# Altium schematic sheet schematic_drive_2024-08-23.schdoc
size 566 x 556 mm
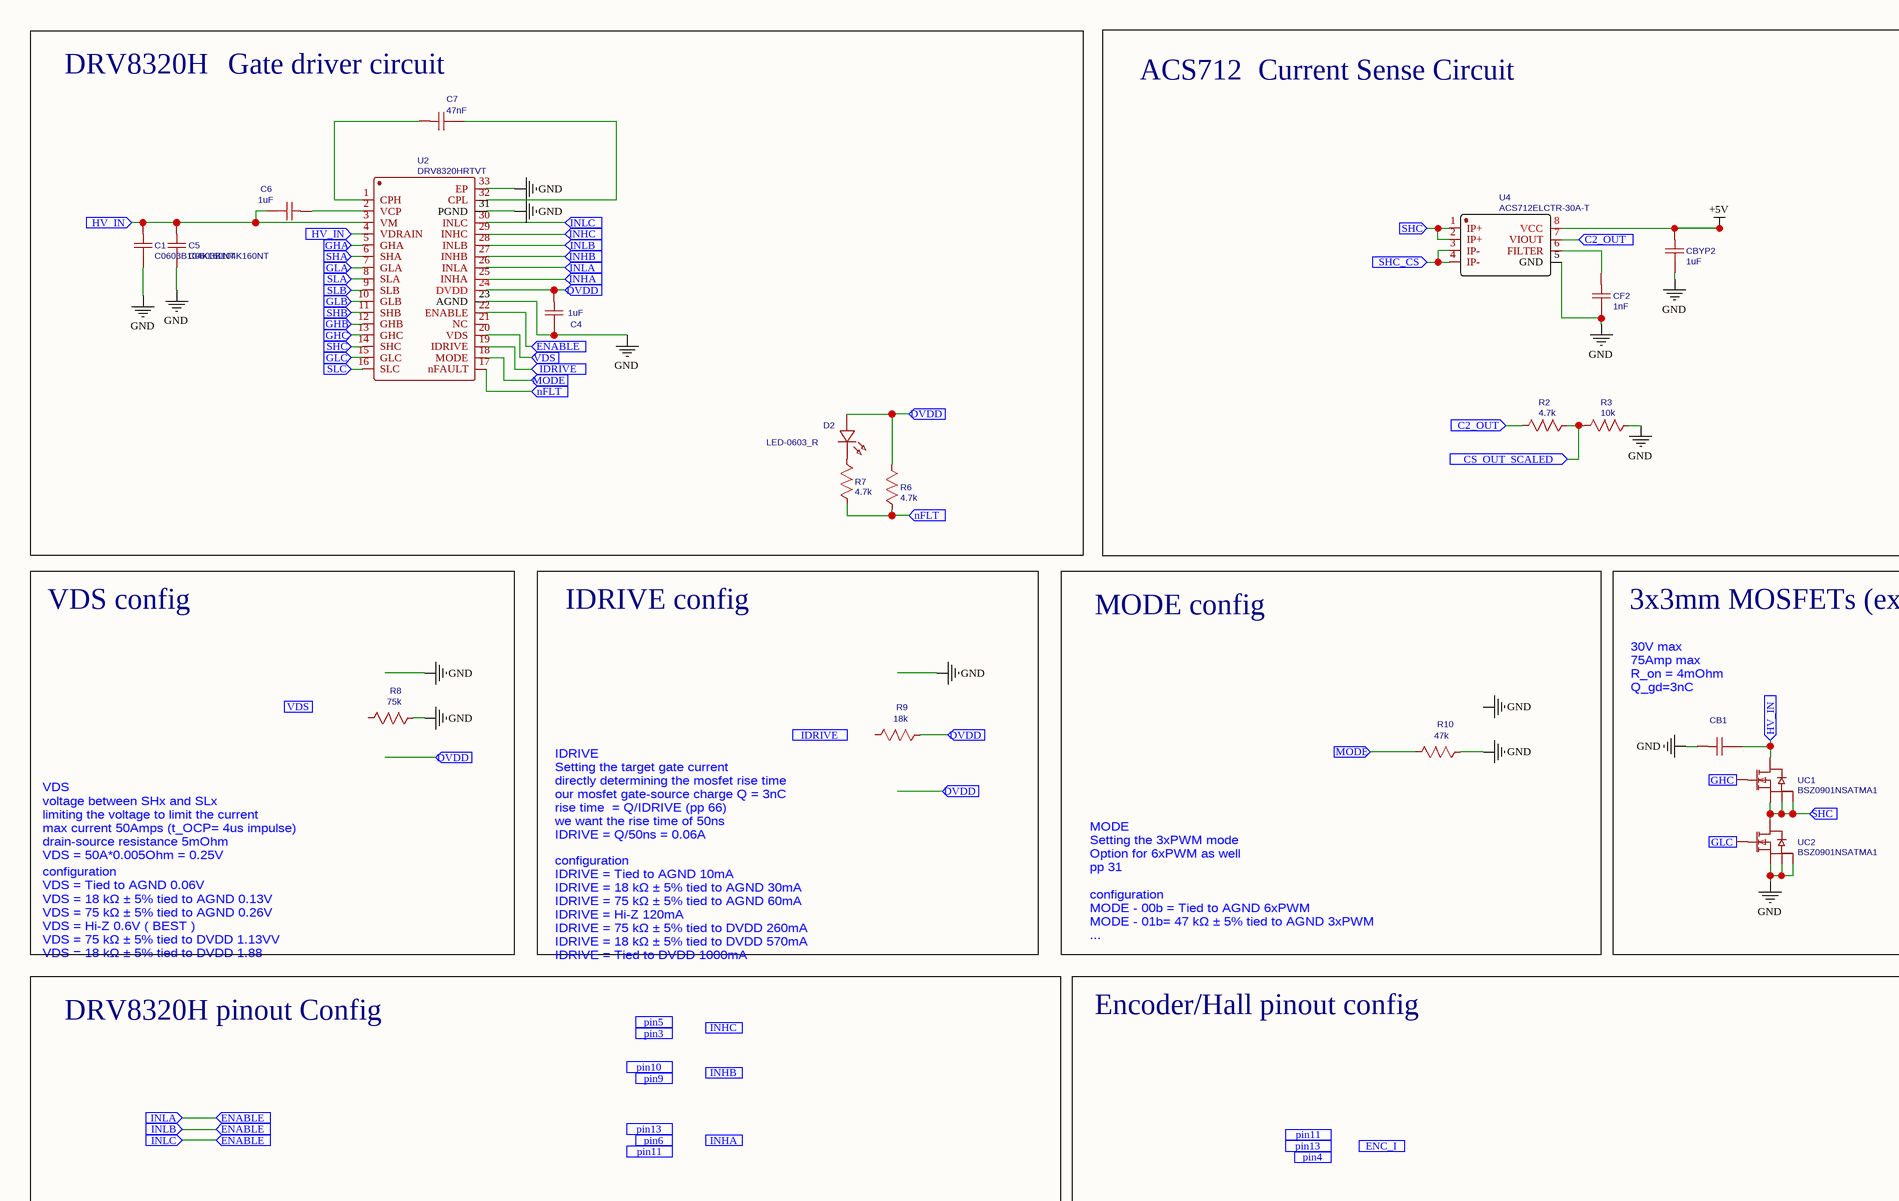
[diagram p0: schematic_drive_2024-08-23.schdoc, top left]
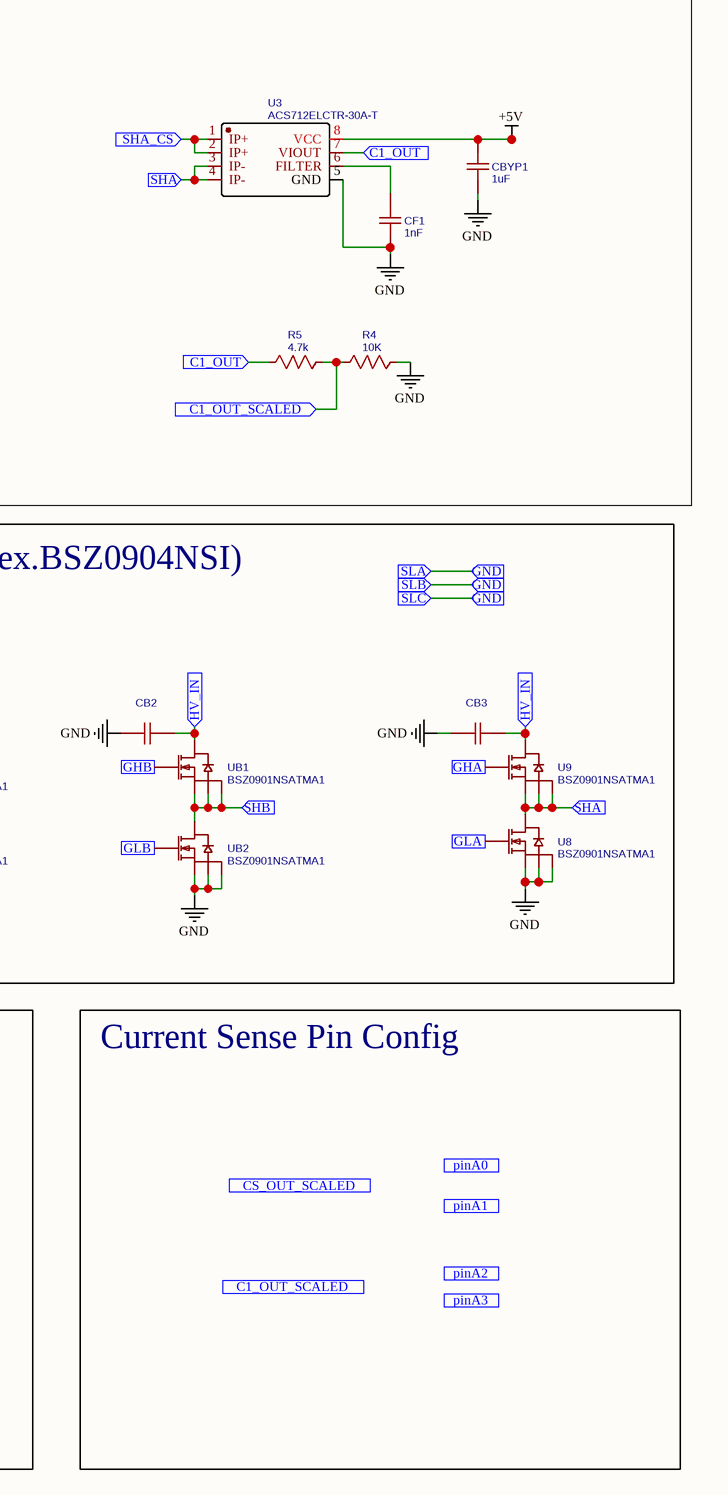
[diagram p1: schematic_drive_2024-08-23.schdoc, top right]
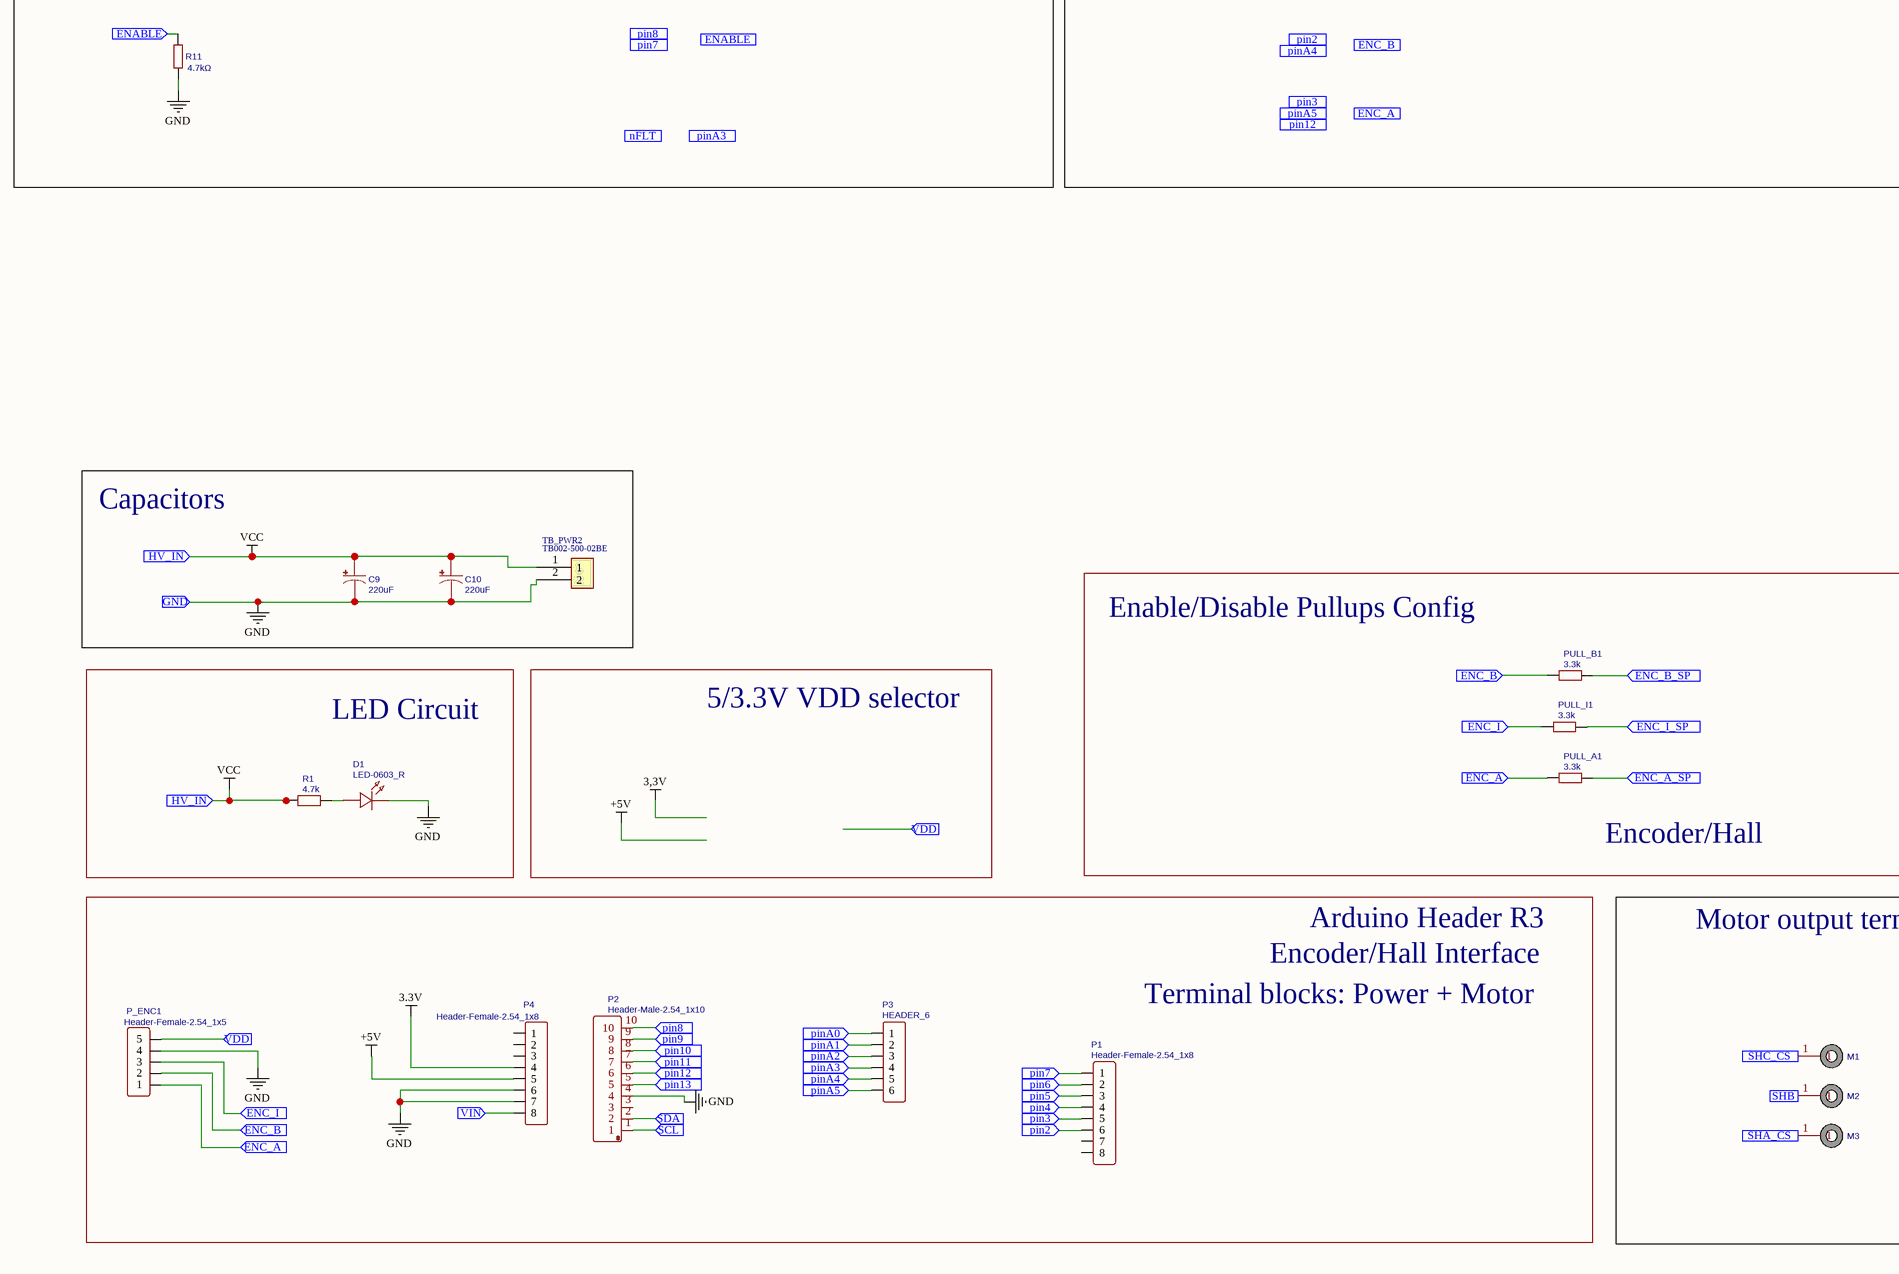
[diagram p2: schematic_drive_2024-08-23.schdoc, bottom left]
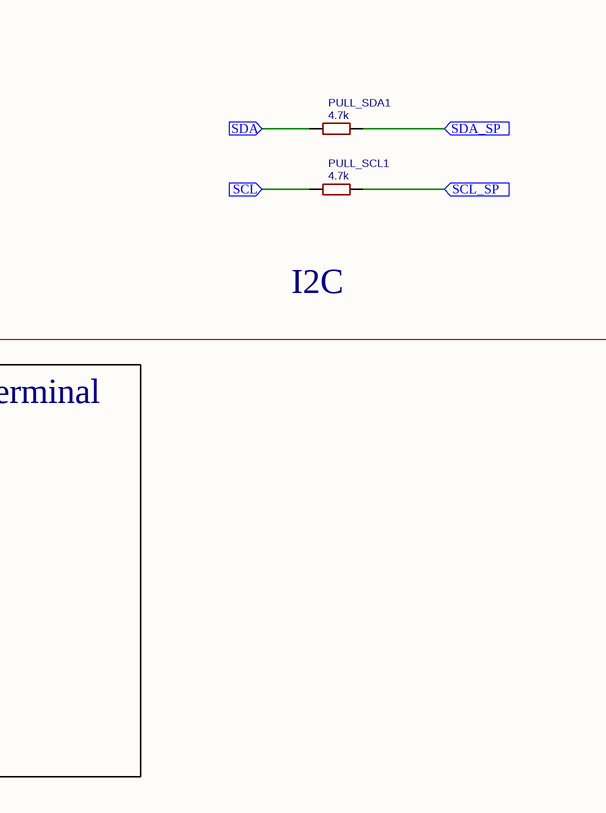
[diagram p3: schematic_drive_2024-08-23.schdoc, bottom right]

## Parts
C1  C0603B104K160NT  [C0603]
C4  1uF  [C0603]
C5  C0603B104K160NT  [C0603]
C6  1uF  [C0603]
C7  47nF  [C0603]
C9  220uF  [CAP-SMD_BD8.0-L8.3-W8.3-LS9.5-FD]
C10  220uF  [CAP-SMD_BD8.0-L8.3-W8.3-LS9.5-FD]
CB1  C0603B104K160NT  [C0603]  (value not drawn)
CB2  C0603B104K160NT  [C0603]  (value not drawn)
CB3  C0603B104K160NT  [C0603]  (value not drawn)
CBYP1  1uF  [C0603]
CBYP2  1uF  [C0603]
CF1  1nF  [C0603]
CF2  1nF  [C0603]
D1  LED-0603_R  [LED0603_RED]
D2  LED-0603_R  [LED0603_RED]
M1  M2 PLATED HOLE WITH MINI HOLES  [M2 PLATED HOLE WITH MINI HOLES]  (value not drawn)
M2  M2 PLATED HOLE WITH MINI HOLES  [M2 PLATED HOLE WITH MINI HOLES]  (value not drawn)
M3  M2 PLATED HOLE WITH MINI HOLES  [M2 PLATED HOLE WITH MINI HOLES]  (value not drawn)
P1  Header-Female-2.54_1x8  [HDR-TH_8P-P2.54-V-F-1]
P2  Header-Male-2.54_1x10  [HDR-TH_10P-P2.54-V-M-1]
P3  HEADER_6  [HDR-M-2.54_1X6]
P4  Header-Female-2.54_1x8  [HDR-TH_8P-P2.54-V-F-1]
P_ENC1  Header-Female-2.54_1x5  [HDR-TH_5P-P2.54-V-F]
PULL_A1  3.3k  [R0603]
PULL_B1  3.3k  [R0603]
PULL_I1  3.3k  [R0603]
PULL_SCL1  4.7k  [R0603]
PULL_SDA1  4.7k  [R0603]
R1  4.7k  [R0603]
R2  4.7k  [R0603]
R3  10k  [R0603]
R4  10K  [R0603]
R5  4.7k  [R0603]
R6  4.7k  [R0603]
R7  4.7k  [R0603]
R8  75k  [R0603]
R9  18k  [R0603]
R10  47k  [R0603]
R11  4.7kΩ  [R0603]
TB_PWR2  TB002-500-02BE  [TB002-500-02BE]
U2  DRV8320HRTVT  [WQFN-32_L5.0-W5.0-P0.50-TL-EP]
U3  ACS712ELCTR-30A-T  [SOIC-8_L5.0-W4.0-P1.27-LS6.0-BL]
U4  ACS712ELCTR-30A-T  [SOIC-8_L5.0-W4.0-P1.27-LS6.0-BL]
U8  BSZ0901NSATMA1  [DFN-8_L3.3-W3.3-P0.65-BL-2]
U9  BSZ0901NSATMA1  [DFN-8_L3.3-W3.3-P0.65-BL-2]
UB1  BSZ0901NSATMA1  [DFN-8_L3.3-W3.3-P0.65-BL-2]
UB2  BSZ0901NSATMA1  [DFN-8_L3.3-W3.3-P0.65-BL-2]
UC1  BSZ0901NSATMA1  [DFN-8_L3.3-W3.3-P0.65-BL-2]
UC2  BSZ0901NSATMA1  [DFN-8_L3.3-W3.3-P0.65-BL-2]

## Blocks framed on the sheet
VDS config: R8
IDRIVE config: R9
MODE config: R10
3x3mm MOSFETs (ex.BSZ0904NSI): CB1-CB3 U8 U9 UB1 UB2 UC1 UC2
DRV8320H pinout Config: R11
Capacitors: C9 C10 TB_PWR2
LED Circuit: D1 R1
Motor output terminal: M1-M3

## Ports
C1_OUT (in), C1_OUT_SCALED (in), C2_OUT (in), CS_OUT_SCALED (in), DVDD (in), ENABLE (in), ENC_A (in), ENC_A_SP (in), ENC_B (in), ENC_B_SP (in), ENC_I (in), ENC_I_SP (in), GHA (in), GHB (in), GHC (in), GLA (in), GLB (in), GLC (in), GND (in), HV_IN (in), IDRIVE (in), INHA (in), INHB (in), INHC (in), INLA (in), INLB (in), INLC (in), MODE (in), nFLT (in), pin2 (in), pin3 (in), pin4 (in), pin5 (in), pin6 (in), pin7 (in), pin8 (in), pin9 (in), pin10 (in), pin11 (in), pin12 (in), pin13 (in), pinA0 (in), pinA1 (in), pinA2 (in), pinA3 (in), pinA4 (in), pinA5 (in), SCL (in), SCL_SP (in), SDA (in), SDA_SP (in), SHA (in), SHA_CS (in), SHB (in), SHC (in), SHC_CS (in), SLA (in), SLB (in), SLC (in), VDD (in), VDS (in), VIN (in)

## Nets
3.3V: P4.4
+5V: CBYP1.2 CBYP2.2 P4.5 U3.8(VCC) U4.8(VCC)
GND: C1.1 C4.1 C5.1 C9.2 C10.2 CB1.2 CB2.1 CB3.2 CBYP1.1 CBYP2.1 CF1.1 CF2.1 D1.2 P2.4 P4.6 P4.7 P_ENC1.4 R3.2 R4.2 R8.2 R10.2 R11.1 TB_PWR2.2 U2.8(SLA) U2.9(SLB) U2.16(SLC) U2.23(AGND) U2.31(PGND) U2.33(EP) U3.5(GND) U4.5(GND) U8.1(S) U8.2(S) U8.3(S) UB2.1(S) UB2.2(S) UB2.3(S) UC2.1(S) UC2.2(S) UC2.3(S) ; port SLC, port SLB, port SLA, port GND
VCC: C1.2 C5.2 C6.1 C9.1 C10.1 CB1.1 CB2.2 CB3.1 R1.2 TB_PWR2.1 U2.3(VM) U2.4(VDRAIN) U9.5(D) UB1.5(D) UC1.5(D) ; port HV_IN
C1_OUT: R5.1 U3.7(VIOUT) ; port C1_OUT
C1_OUT_SCALED: R4.1 R5.2 ; port C1_OUT_SCALED
C2_OUT: R2.1 U4.7(VIOUT) ; port C2_OUT
CS_OUT_SCALED: R2.2 R3.1 ; port CS_OUT_SCALED
DVDD: C4.2 D2.1 R6.2 R9.2 U2.24(DVDD) ; port DVDD
ENABLE: R11.2 U2.22(ENABLE) U2.26(INLA) U2.28(INLB) U2.30(INLC) ; port ENABLE, port INLA, port INLB, port INLC
ENC_A: P_ENC1.1 PULL_A1.2 ; port ENC_A
ENC_A_SP: PULL_A1.1 ; port ENC_A_SP
ENC_B: P_ENC1.2 PULL_B1.2 ; port ENC_B
ENC_B_SP: PULL_B1.1 ; port ENC_B_SP
ENC_I: P_ENC1.3 PULL_I1.2 ; port ENC_I
ENC_I_SP: PULL_I1.1 ; port ENC_I_SP
GHA: U2.5(GHA) U9.4(G) ; port GHA
GHB: U2.12(GHB) UB1.4(G) ; port GHB
GHC: U2.13(GHC) UC1.4(G) ; port GHC
GLA: U2.7(GLA) U8.4(G) ; port GLA
GLB: U2.10(GLB) UB2.4(G) ; port GLB
GLC: U2.15(GLC) UC2.4(G) ; port GLC
IDRIVE: U2.19(IDRIVE) ; port IDRIVE
INHA: U2.25(INHA) ; port INHA
INHB: U2.27(INHB) ; port INHB
INHC: U2.29(INHC) ; port INHC
MODE: R10.1 U2.18(MODE) ; port MODE
nFLT: R6.1 R7.1 U2.17(nFAULT) ; port nFLT
pin2: P1.6 ; port pin2
pin3: P1.5 ; port pin3
pin4: P1.4 ; port pin4
pin5: P1.3 ; port pin5
pin6: P1.2 ; port pin6
pin7: P1.1 ; port pin7
pin8: P2.10 ; port pin8
pin9: P2.9 ; port pin9
pin10: P2.8 ; port pin10
pin11: P2.7 ; port pin11
pin12: P2.6 ; port pin12
pin13: P2.5 ; port pin13
pinA0: P3.1 ; port pinA0
pinA1: P3.2 ; port pinA1
pinA2: P3.3 ; port pinA2
pinA3: P3.4 ; port pinA3
pinA4: P3.5 ; port pinA4
pinA5: P3.6 ; port pinA5
SCL: P2.1 PULL_SCL1.2 ; port SCL
SCL_SP: PULL_SCL1.1 ; port SCL_SP
SDA: P2.2 PULL_SDA1.2 ; port SDA
SDA_SP: PULL_SDA1.1 ; port SDA_SP
SHA: U2.6(SHA) U3.3(IP-) U3.4(IP-) U8.5(D) U9.1(S) U9.2(S) U9.3(S) ; port SHA
SHA_CS: M3.1 U3.1(IP+) U3.2(IP+) ; port SHA_CS
SHB: M2.1 U2.11(SHB) UB1.1(S) UB1.2(S) UB1.3(S) UB2.5(D) ; port SHB
SHC: U2.14(SHC) U4.1(IP+) U4.2(IP+) UC1.1(S) UC1.2(S) UC1.3(S) UC2.5(D) ; port SHC
SHC_CS: M1.1 U4.3(IP-) U4.4(IP-) ; port SHC_CS
VDD: P_ENC1.5 ; port VDD
VDS: U2.20(VDS) ; port VDS
VIN: P4.8 ; port VIN
NetC6_2: C6.2 U2.2(VCP)
NetC7_1: C7.1 U2.32(CPL)
NetC7_2: C7.2 U2.1(CPH)
NetCF1_2: CF1.2 U3.6(FILTER)
NetCF2_2: CF2.2 U4.6(FILTER)
NetD1_1: D1.1 R1.1
NetD2_2: D2.2 R7.2

Not connected (* = marked no-connect by the designer): P1 7 8; P2 3; P4 1 2 3; R8 1; R9 1; U2 21(NC)

## Notes on the sheet
- DRV8320H
- (near C7) Gate driver circuit
- ACS712
- Current Sense Circuit
- (near CB1) 30V max
  75Amp max
  R_on = 4mOhm
  Q_gd=3nC
- VDS
  voltage between SHx and SLx
  limiting the voltage to limit the current
  max current 50Amps (t_OCP= 4us impulse)
  drain-source resistance 5mOhm
  VDS = 50A*0.005Ohm = 0.25V
- IDRIVE
  Setting the target gate current
  directly determining the mosfet rise time
  our mosfet gate-source charge Q = 3nC
  rise time  = Q/IDRIVE (pp 66)
  we want the rise time of 50ns
  IDRIVE = Q/50ns = 0.06A
- MODE
  Setting the 3xPWM mode
  Option for 6xPWM as well
  pp 31
- configuration
  VDS = Tied to AGND 0.06V
  VDS = 18 kΩ ± 5% tied to AGND 0.13V
  VDS = 75 kΩ ± 5% tied to AGND 0.26V
  VDS = Hi-Z 0.6V ( BEST )
  VDS = 75 kΩ ± 5% tied to DVDD 1.13VV
  VDS = 18 kΩ ± 5% tied to DVDD 1.88
- configuration
  IDRIVE = Tied to AGND 10mA
  IDRIVE = 18 kΩ ± 5% tied to AGND 30mA
  IDRIVE = 75 kΩ ± 5% tied to AGND 60mA
  IDRIVE = Hi-Z 120mA
  IDRIVE = 75 kΩ ± 5% tied to DVDD 260mA
  IDRIVE = 18 kΩ ± 5% tied to DVDD 570mA
  IDRIVE = Tied to DVDD 1000mA
- configuration
  MODE - 00b = Tied to AGND 6xPWM
  MODE - 01b= 47 kΩ ± 5% tied to AGND 3xPWM
  ...
- Current Sense Pin Config
- Encoder/Hall pinout config
- Enable/Disable Pullups Config
- 5/3.3V VDD selector
- Encoder/Hall
- I2C
- Encoder/Hall Interface
- Arduino Header R3
- Terminal blocks: Power + Motor
- Labels drawn without touching a wire or pin: GND

## Library data of the parts
C1 C5 CB1-CB3 = C0603B104K160NT: Manufacturer: TORCH(火炬); Contributor: lcsc; Supplier: LCSC; Supplier Part: C17702750; Manufacturer Part: C0603B104K160NT; spicePre: U; spiceSymbolName: C0603B104K160NT
C4 C6 CBYP1 CBYP2 = 1uF: nameAlias: Value(F); Contributor: LCEDA_Lib; spicePre: C; spiceSymbolName: C_0603_US
C7 = 47nF: nameAlias: Value(F); Contributor: LCEDA_Lib; spicePre: C; spiceSymbolName: C_0603_US
C9 C10 = 220uF: Manufacturer: VT(首科); Manufacturer Part: VT1V221M-CRF10; nameAlias: Value; Contributor: LCSC; Supplier: LCSC; Supplier Part: C305376; JLCPCB Part Class: Extended Part; spicePre: C; spiceSymbolName: VT1V221M-CRF10
CF1 CF2 = 1nF: nameAlias: Value(F); Contributor: LCEDA_Lib; spicePre: C; spiceSymbolName: C_0603_US
D1 D2 = LED-0603_R: Manufacturer: EVERLIGHT(台湾亿光); Manufacturer Part: 19-217/R6C-AL1M2VY/3T; Contributor: LCEDA_01; Supplier Part: C72044; Supplier: LCSC; spicePre: L; spiceSymbolName: LED-0603_R
M1-M3 = M2 PLATED HOLE WITH MINI HOLES: Contributor: Andrew Young; spicePre: U; spiceSymbolName: M2 PLATED HOLE WITH MINI HOLES
P1 P4 = Header-Female-2.54_1x8: Manufacturer: BOOMELE; Manufacturer Part: Female headerHDR1X8-2.54; Supplier: LCSC; Supplier Part: C27438; JLCPCB Part Class: Extended Part; spicePre: P; spiceSymbolName: Header-Female-2.54_1x8
P2 = Header-Male-2.54_1x10: Manufacturer Part: Headers  Pins2.54mm1*10P; Supplier: LCSC; Supplier Part: C57369; JLCPCB Part Class: Extended Part; spicePre: H; spiceSymbolName: Header-Male-2.54_1x10
P_ENC1 = Header-Female-2.54_1x5: Manufacturer: BOOMELE; Manufacturer Part: 2.54mm 1*5p Female header; Supplier: LCSC; Supplier Part: C50950; JLCPCB Part Class: Extended Part; spicePre: H; spiceSymbolName: Header-Female-2.54_1x5
PULL_A1 PULL_B1 PULL_I1 = 3.3k: nameAlias: Resistance; Resistance (Ohms): 3.3k; JLCPCB Part Class: Basic Part; spicePre: R; spiceSymbolName: 0603WAF4701T5E
  PULL_B1: Supplier: LCSC
PULL_SCL1 PULL_SDA1 R1 = 4.7k: Manufacturer: UniOhm; Manufacturer Part: 0603WAF4701T5E; nameAlias: Resistance; Supplier: LCSC; Supplier Part: C23162; Resistance (Ohms): 4.7K; JLCPCB Part Class: Basic Part; spicePre: R; spiceSymbolName: 0603WAF4701T5E
R2 R5-R7 = 4.7k: nameAlias: Value(Ω); Contributor: LCEDA_Lib; spicePre: R; spiceSymbolName: R_0603_US
R3 = 10k: nameAlias: Value(Ω); Contributor: LCEDA_Lib; spicePre: R; spiceSymbolName: R_0603_US
R4 = 10K: nameAlias: Value(Ω); Contributor: LCEDA_Lib; spicePre: R; spiceSymbolName: R_0603_US
R8 = 75k: nameAlias: Value(Ω); Contributor: LCEDA_Lib; spicePre: R; spiceSymbolName: R_0603_US
R9 = 18k: nameAlias: Value(Ω); Contributor: LCEDA_Lib; spicePre: R; spiceSymbolName: R_0603_US
R10 = 47k: nameAlias: Value(Ω); Contributor: LCEDA_Lib; spicePre: R; spiceSymbolName: R_0603_US
R11 = 4.7kΩ: Manufacturer: UniOhm; Manufacturer Part: 0603WAF4701T5E; nameAlias: Resistance; Resistance (Ohms): 4.7K; Supplier: LCSC; Supplier Part: C23162; JLCPCB Part Class: Basic Part; spicePre: R; spiceSymbolName: 0603WAF4701T5E
U2 = DRV8320HRTVT: Manufacturer: TI(德州仪器); Contributor: LCSC; Supplier: LCSC; Supplier Part: C2864967; Manufacturer Part: DRV8320HRTVT; JLCPCB Part Class: Extended Part; spicePre: U; spiceSymbolName: DRV8320HRTVT
U3 U4 = ACS712ELCTR-30A-T: Manufacturer: ALLEGRO(美国埃戈罗); Supplier: LCSC; Manufacturer Part: ACS712ELCTR-30A-T; Supplier Part: C9932; JLCPCB Part Class: Extended Part; spicePre: U; spiceSymbolName: ACS712ELCTR-30A-T
U8 U9 UB1 UB2 UC1 UC2 = BSZ0901NSATMA1: Manufacturer: Infineon(英飞凌); Contributor: lcsc; Supplier: LCSC; Supplier Part: C3289311; Manufacturer Part: BSZ0901NSATMA1; JLCPCB Part Class: Extended Part; spicePre: U; spiceSymbolName: BSZ0901NSATMA1
P3 = HEADER_6: spicePre: J; spiceSymbolName: HEADER_6
TB_PWR2 = TB002-500-02BE: Supplier 1: Mouser; Supplier Part Number 1: 490-TB002-500-02BE